# Altium schematic sheet HW_OPTO.SchDoc
size A4
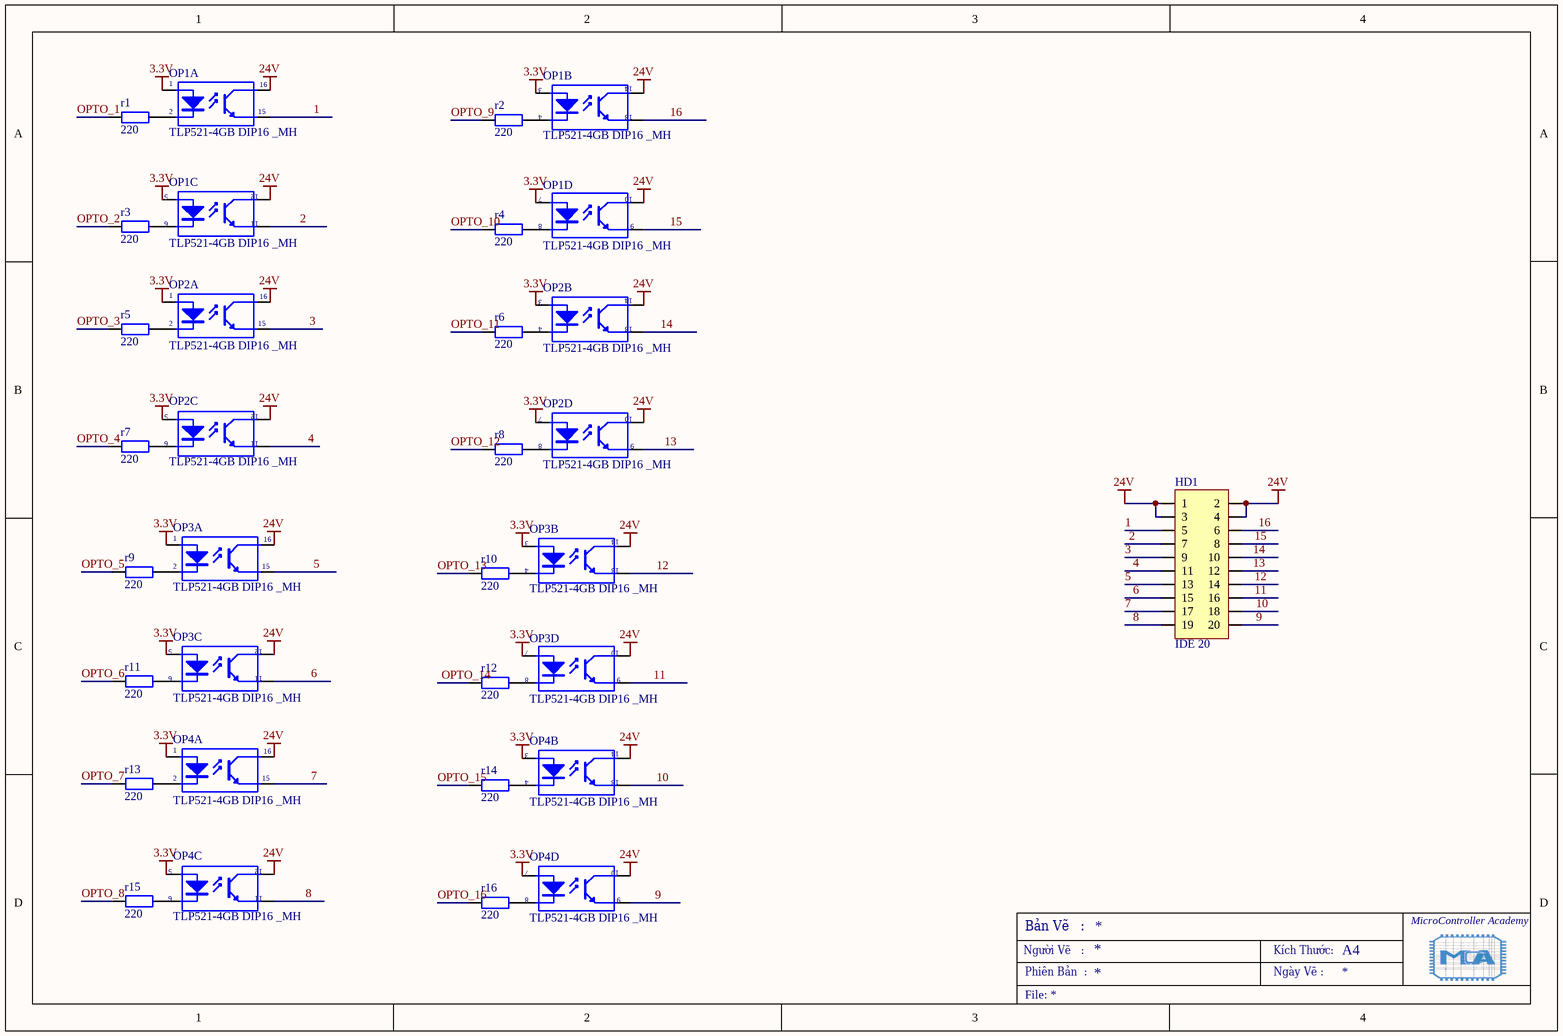
[diagram p0: HW_OPTO.SchDoc]

## Parts
HD1  IDE 20  [CABLE 20]
OP1  TLP521-4GB DIP16 _MH  [DIP16]  (parts A,B,C,D of 4)
OP2  TLP521-4GB DIP16 _MH  [DIP16]  (parts A,B,C,D of 4)
OP3  TLP521-4GB DIP16 _MH  [DIP16]  (parts A,B,C,D of 4)
OP4  TLP521-4GB DIP16 _MH  [DIP16]  (parts A,B,C,D of 4)
r1  220  [Tro SMD 0805]
r2  220  [Tro SMD 0805]
r3  220  [Tro SMD 0805]
r4  220  [Tro SMD 0805]
r5  220  [Tro SMD 0805]
r6  220  [Tro SMD 0805]
r7  220  [Tro SMD 0805]
r8  220  [Tro SMD 0805]
r9  220  [Tro SMD 0805]
r10  220  [Tro SMD 0805]
r11  220  [Tro SMD 0805]
r12  220  [Tro SMD 0805]
r13  220  [Tro SMD 0805]
r14  220  [Tro SMD 0805]
r15  220  [Tro SMD 0805]
r16  220  [Tro SMD 0805]

## Nets
3.3V: OP1.1(A) OP1.3(A) OP1.5(A) OP1.7(A) OP2.1(A) OP2.3(A) OP2.5(A) OP2.7(A) OP3.1(A) OP3.3(A) OP3.5(A) OP3.7(A) OP4.1(A) OP4.3(A) OP4.5(A) OP4.7(A)
24V: HD1.1 HD1.2 HD1.3 HD1.4 OP1.10(C) OP1.12(C) OP1.14(C) OP1.16(C) OP2.10(C) OP2.12(C) OP2.14(C) OP2.16(C) OP3.10(C) OP3.12(C) OP3.14(C) OP3.16(C) OP4.10(C) OP4.12(C) OP4.14(C) OP4.16(C)
1: HD1.5 OP1.15(E)
2: HD1.7 OP1.11(E)
3: HD1.9 OP2.15(E)
4: HD1.11 OP2.11(E)
5: HD1.13 OP3.15(E)
6: HD1.15 OP3.11(E)
7: HD1.17 OP4.15(E)
8: HD1.19 OP4.11(E)
9: HD1.20 OP4.9(E)
10: HD1.18 OP4.13(E)
11: HD1.16 OP3.9(E)
12: HD1.14 OP3.13(E)
13: HD1.12 OP2.9(E)
14: HD1.10 OP2.13(E)
15: HD1.8 OP1.9(E)
16: HD1.6 OP1.13(E)
OPTO_1: r1.1
OPTO_2: r3.1
OPTO_3: r5.1
OPTO_4: r7.1
OPTO_5: r9.1
OPTO_6: r11.1
OPTO_7: r13.1
OPTO_8: r15.1
OPTO_9: r2.1
OPTO_10: r4.1
OPTO_11: r6.1
OPTO_12: r8.1
OPTO_13: r10.1
OPTO_14: r12.1
OPTO_15: r14.1
OPTO_16: r16.1
NetOP1_2: OP1.2(K) r1.2
NetOP1_4: OP1.4(K) r2.2
NetOP1_6: OP1.6(K) r3.2
NetOP1_8: OP1.8(K) r4.2
NetOP2_2: OP2.2(K) r5.2
NetOP2_4: OP2.4(K) r6.2
NetOP2_6: OP2.6(K) r7.2
NetOP2_8: OP2.8(K) r8.2
NetOP3_2: OP3.2(K) r9.2
NetOP3_4: OP3.4(K) r10.2
NetOP3_6: OP3.6(K) r11.2
NetOP3_8: OP3.8(K) r12.2
NetOP4_2: OP4.2(K) r13.2
NetOP4_4: OP4.4(K) r14.2
NetOP4_6: OP4.6(K) r15.2
NetOP4_8: OP4.8(K) r16.2

## Notes on the sheet
- MicroController Academy
- Người Vẽ   :
- Phiên Bản  :
- Bản Vẽ   :
- Kích Thước:
- Ngày Vẽ :
- A4
- File:

## Library data of the parts
HD1 = IDE 20: IDE header 20P
r1-r16 = TRO_SMD_0805_MH: TRO_SMD_0805
OP1-OP4 = TLP521-4GB DIP16 _MH: Value: TLP521-4